# Altium schematic sheet KeyLED.SchDoc
size A3
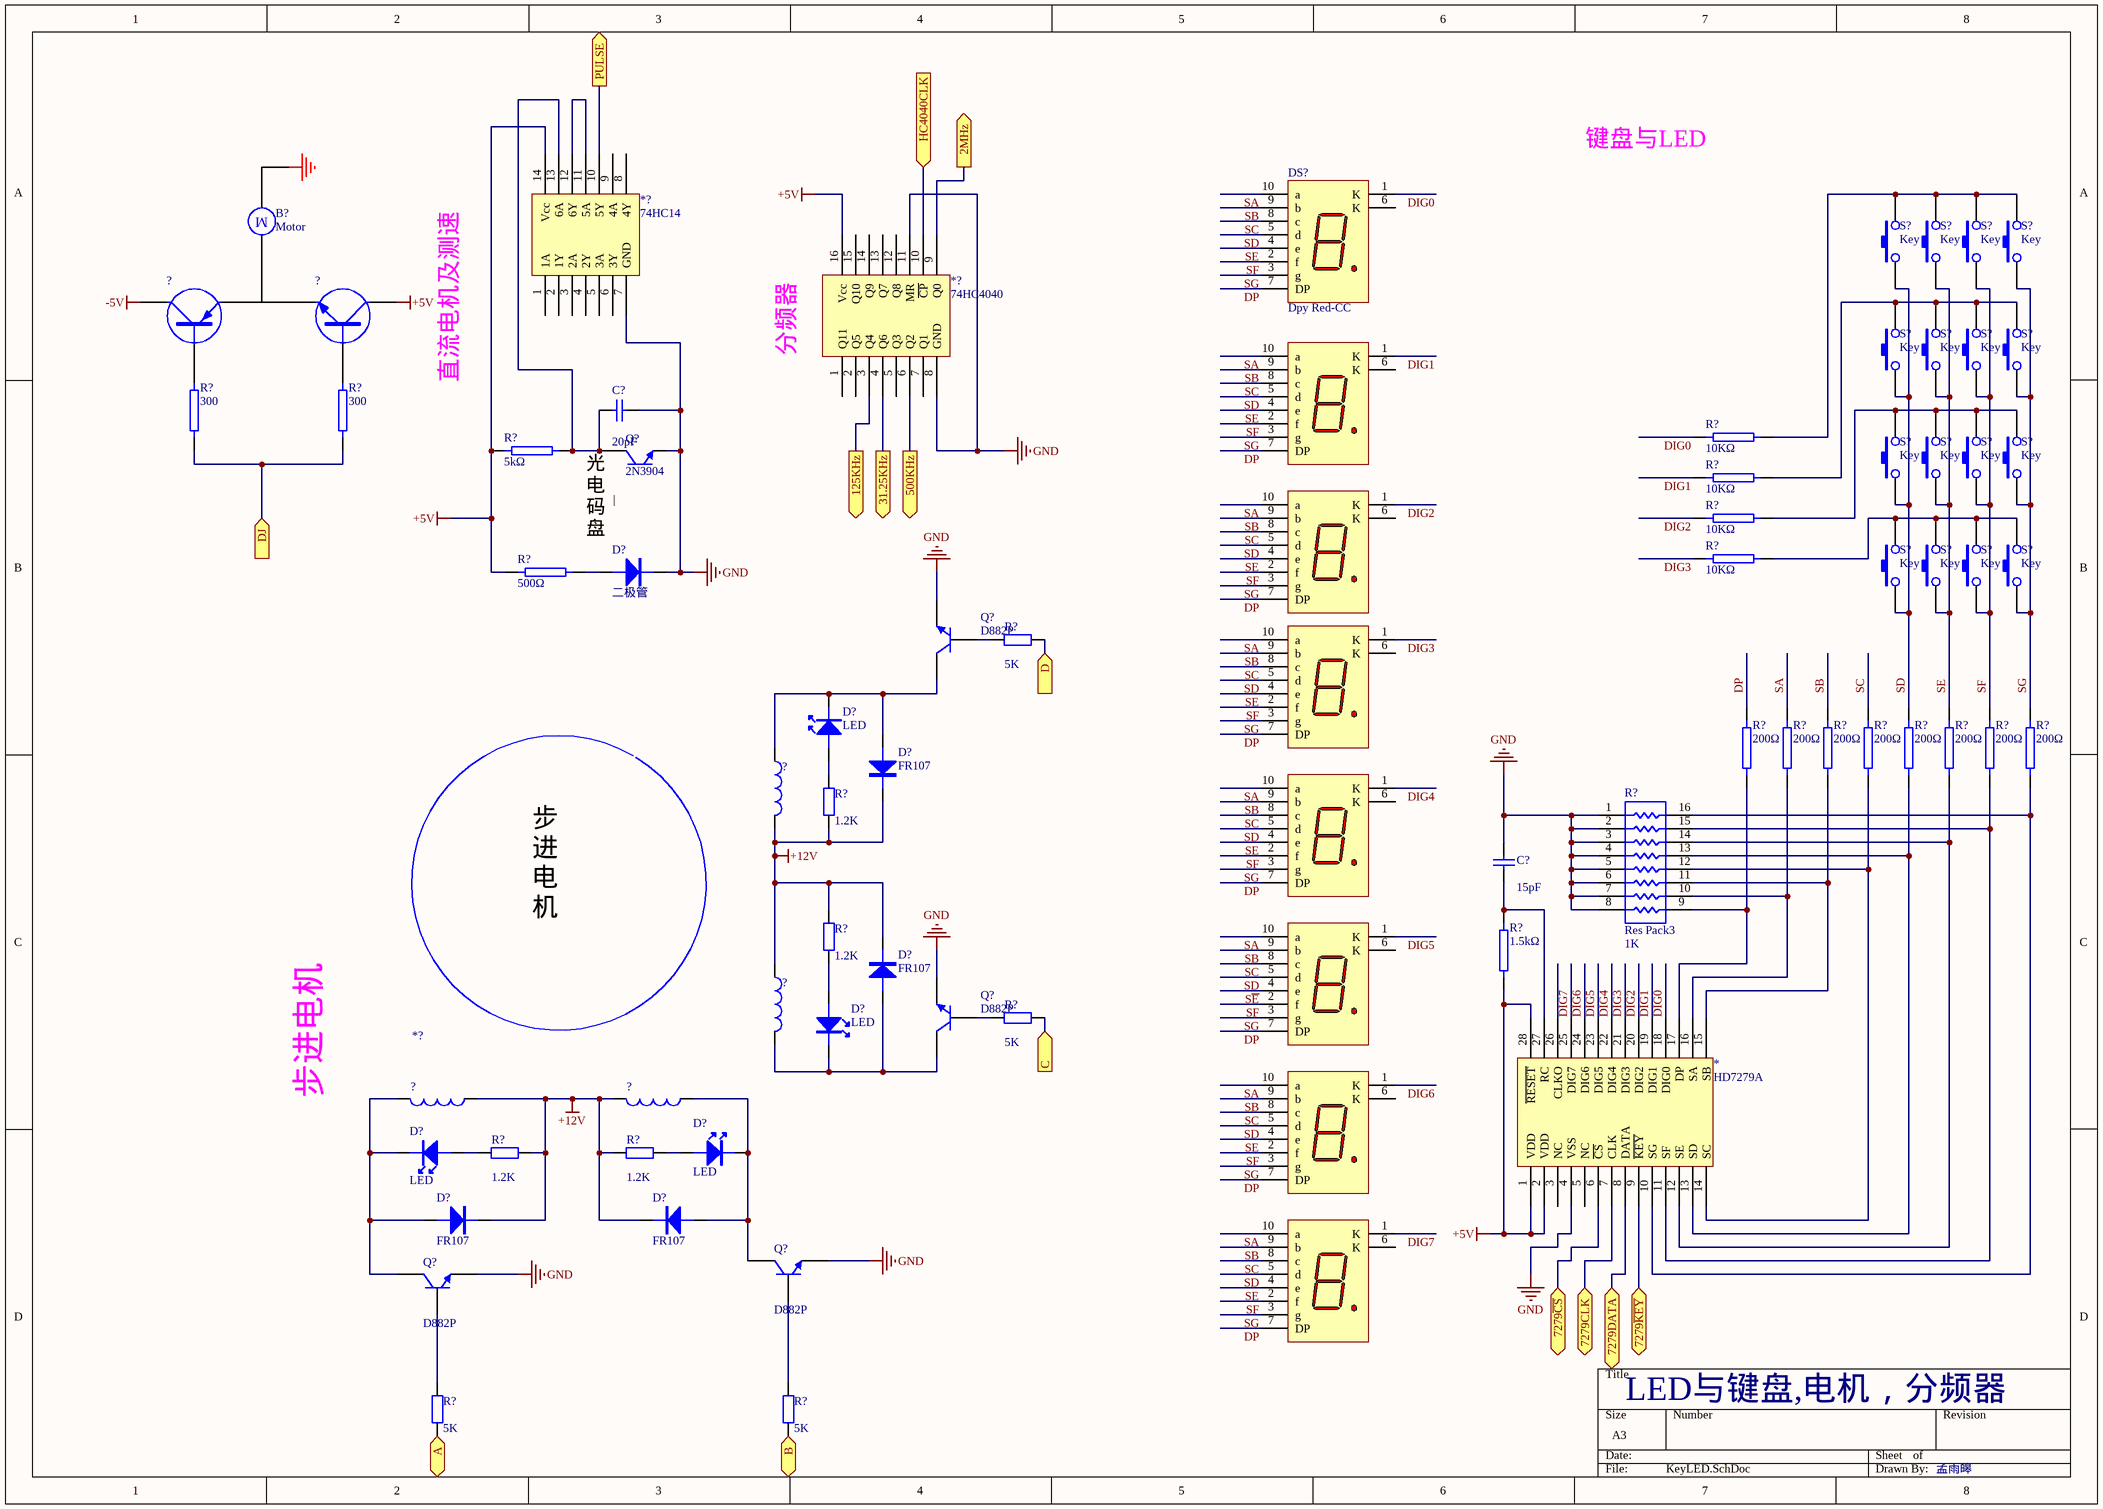
[diagram p0: KeyLED.SchDoc]

## Parts
(Parts that share a designator on the sheet are numbered #1, #2 ... from top to bottom, then left to right.)
*  HD7279A
*?#1  74HC14
*?#2  74HC4040
*?#3  bujindianji  (value not drawn)
?#1  (no value)
?#2  (no value)
?#3  Inductor  [INDC1005AL]  (value not drawn)
?#4  (no value)  [INDC1005AL]
?#5  Inductor  [INDC1005AL]  (value not drawn)
?#6  Inductor  [INDC1005AL]  (value not drawn)
B?  Motor  [RB5-10.5]
C?#1  value 20pF  [RAD-0.3]
C?#2  value 15pF  [RAD-0.3]
D?#1  二极管
D?#2  LED
D?#3  FR107
D?#4  FR107
D?#5  LED
D?#6  LED
D?#7  LED
D?#8  FR107
D?#9  FR107
DS?#1  Dpy Red-CC  [A]
DS?#2  Dpy Red-CC  [A]  (value not drawn)
DS?#3  Dpy Red-CC  [A]  (value not drawn)
DS?#4  Dpy Red-CC  [A]  (value not drawn)
DS?#5  Dpy Red-CC  [A]  (value not drawn)
DS?#6  Dpy Red-CC  [A]  (value not drawn)
DS?#7  Dpy Red-CC  [A]  (value not drawn)
DS?#8  Dpy Red-CC  [A]  (value not drawn)
Q?#1  2N3904  [BCY-W3/E4]
Q?#2  D882P  [sot-23]
Q?#3  D882P  [sot-23]
Q?#4  D882P  [sot-23]
Q?#5  D882P  [sot-23]
R?#1  300
R?#2  300
R?#3  10KΩ
R?#4  5kΩ
R?#5  10KΩ
R?#6  10KΩ
R?#7  10KΩ
R?#8  500Ω
R?#9  value 5K  [AXIAL-0.4]
R?#10  200Ω
R?#11  200Ω
R?#12  200Ω
R?#13  200Ω
R?#14  200Ω
R?#15  200Ω
R?#16  200Ω
R?#17  200Ω
R?#18  Res Pack3  value 1K  [SO-16_N]
R?#19  value 1.2K  [AXIAL-0.4]
R?#20  value 1.2K  [AXIAL-0.4]
R?#21  1.5kΩ
R?#22  value 5K  [AXIAL-0.4]
R?#23  value 1.2K  [AXIAL-0.4]
R?#24  value 1.2K  [AXIAL-0.4]
R?#25  value 5K  [AXIAL-0.4]
R?#26  value 5K  [AXIAL-0.4]
S?#1  Key
S?#2  Key
S?#3  Key
S?#4  Key
S?#5  Key
S?#6  Key
S?#7  Key
S?#8  Key
S?#9  Key
S?#10  Key
S?#11  Key
S?#12  Key
S?#13  Key
S?#14  Key
S?#15  Key
S?#16  Key

## Ports
2MHz (out), 31.25KHz (out), 125KHz (out), 500KHz (out), 7279CLK, 7279DATA, 7279~{CS} (bidir), 7279~{KEY}, A (in), B (in), C (in), D (in), DJ (in), HC4040CLK (in), PULSE (out)

## Nets
+5V: *.1(VDD) *.2(VDD) *.28(~{RESET}) *?#1.14(Vcc) *?#2.16(Vcc) ?#2.2(C) R?#4.2 R?#8.2 R?#21.2
+12V: ?#3.2 ?#4.1 ?#5.1 ?#6.2 D?#3.K D?#4.K D?#8.K D?#9.K R?#19.1 R?#20.1 R?#23.1 R?#24.1
-5V: ?#1.3(C)
GND: *.4(VSS) *?#1.7(GND) *?#2.8(GND) *?#2.11(MR) C?#1.1 C?#2.1 D?#1.K Q?#1.1(E) Q?#2.2(E) Q?#3.2(E) Q?#4.2(E) Q?#5.2(E) R?#18.1 R?#18.2 R?#18.3 R?#18.4 R?#18.5 R?#18.6 R?#18.7 R?#18.8
2MHz: *?#2.9(Q0) ; port 2MHz
31.25KHz: *?#2.4(Q6) ; port 31.25KHz
125KHz: *?#2.3(Q4) ; port 125KHz
500KHz: *?#2.6(Q2) ; port 500KHz
7279~{CS}: *.6(~{CS}) ; port 7279~{CS}
7279CLK: *.7(CLK) ; port 7279CLK
7279DATA: *.8(DATA) ; port 7279DATA
7279~{KEY}: *.9(~{KEY}) ; port 7279~{KEY}
A: R?#25.1 ; port A
B: R?#26.1 ; port B
C: R?#22.1 ; port C
D: R?#9.1 ; port D
DIG0: *.18(DIG0) DS?#1.1(K) R?#3.2
DIG1: *.19(DIG1) DS?#2.1(K) R?#5.2
DIG2: *.20(DIG2) DS?#3.1(K) R?#6.2
DIG3: *.21(DIG3) DS?#4.1(K) R?#7.2
DIG4: *.22(DIG4) DS?#5.1(K)
DIG5: *.23(DIG5) DS?#6.1(K)
DIG6: *.24(DIG6) DS?#7.1(K)
DIG7: *.25(DIG7) DS?#8.1(K)
DJ: R?#1.1 R?#2.1 ; port DJ
DP: DS?#1.7(DP) DS?#2.7(DP) DS?#3.7(DP) DS?#4.7(DP) DS?#5.7(DP) DS?#6.7(DP) DS?#7.7(DP) DS?#8.7(DP) R?#10.2
HC4040CLK: *?#2.10(~{CP}) ; port HC4040CLK
PULSE: *?#1.10(5Y) ; port PULSE
SA: DS?#1.10(a) DS?#2.10(a) DS?#3.10(a) DS?#4.10(a) DS?#5.10(a) DS?#6.10(a) DS?#7.10(a) DS?#8.10(a) R?#11.2
SB: DS?#1.9(b) DS?#2.9(b) DS?#3.9(b) DS?#4.9(b) DS?#5.9(b) DS?#6.9(b) DS?#7.9(b) DS?#8.9(b) R?#12.2
SC: DS?#1.8(c) DS?#2.8(c) DS?#3.8(c) DS?#4.8(c) DS?#5.8(c) DS?#6.8(c) DS?#7.8(c) DS?#8.8(c) R?#13.2
SD: DS?#1.5(d) DS?#2.5(d) DS?#3.5(d) DS?#4.5(d) DS?#5.5(d) DS?#6.5(d) DS?#7.5(d) DS?#8.5(d) R?#14.2 S?#1.1 S?#5.1 S?#9.1 S?#13.1
SE: DS?#1.4(e) DS?#2.4(e) DS?#3.4(e) DS?#4.4(e) DS?#5.4(e) DS?#7.4(e) DS?#8.4(e) R?#15.2 S?#2.1 S?#6.1 S?#10.1 S?#14.1
S~{E}: DS?#6.4(e)
SF: DS?#1.2(f) DS?#2.2(f) DS?#3.2(f) DS?#4.2(f) DS?#5.2(f) DS?#6.2(f) DS?#7.2(f) DS?#8.2(f) R?#16.2 S?#3.1 S?#7.1 S?#11.1 S?#15.1
SG: DS?#1.3(g) DS?#2.3(g) DS?#3.3(g) DS?#4.3(g) DS?#5.3(g) DS?#6.3(g) DS?#7.3(g) DS?#8.3(g) R?#17.2 S?#4.1 S?#8.1 S?#12.1 S?#16.1
Net*?#1_11: *?#1.11(5A) *?#1.12(6Y)
Net*?#1_13: *?#1.13(6A) C?#1.2 Q?#1.3(C) R?#4.1
Net*_10: *.10(SG) R?#17.1 R?#18.16
Net*_11: *.11(SF) R?#16.1 R?#18.15
Net*_12: *.12(SE) R?#15.1 R?#18.14
Net*_13: *.13(SD) R?#14.1 R?#18.13
Net*_14: *.14(SC) R?#13.1 R?#18.12
Net*_15: *.15(SB) R?#12.1 R?#18.11
Net*_16: *.16(SA) R?#11.1 R?#18.10
Net*_17: *.17(DP) R?#10.1 R?#18.9
Net*_27: *.27(RC) C?#2.2 R?#21.1
Net?#1_1: ?#1.1(B) R?#1.2
Net?#2_1: ?#2.1(B) R?#2.2
Net?#3_1: ?#3.1 D?#2.2 D?#3.A Q?#2.3(C)
Net?#4_2: ?#4.2 D?#4.A D?#5.2 Q?#3.3(C)
Net?#5_2: ?#5.2 D?#6.2 D?#8.A Q?#5.3(C)
Net?#6_1: ?#6.1 D?#7.2 D?#9.A Q?#4.3(C)
NetD?#1_A: D?#1.A R?#8.1
NetD?#2_1: D?#2.1 R?#19.2
NetD?#5_1: D?#5.1 R?#20.2
NetD?#6_1: D?#6.1 R?#24.2
NetD?#7_1: D?#7.1 R?#23.2
NetQ?#2_1: Q?#2.1(B) R?#9.2
NetQ?#3_1: Q?#3.1(B) R?#22.2
NetQ?#4_1: Q?#4.1(B) R?#26.2
NetQ?#5_1: Q?#5.1(B) R?#25.2
NetR?#3_1: R?#3.1 S?#1.2 S?#2.2 S?#3.2 S?#4.2
NetR?#5_1: R?#5.1 S?#5.2 S?#6.2 S?#7.2 S?#8.2
NetR?#6_1: R?#6.1 S?#9.2 S?#10.2 S?#11.2 S?#12.2
NetR?#7_1: R?#7.1 S?#13.2 S?#14.2 S?#15.2 S?#16.2

Not connected (* = marked no-connect by the designer): * 3(NC) 5(NC) 26(CLKO); *?#1 1(1A) 2(1Y) 3(2A) 4(2Y) 5(3A) 6(3Y) 8(4Y) 9(4A); *?#2 1(Q11) 2(Q5) 5(Q3) 7(Q1) 12(Q8) 13(Q7) 14(Q9) 15(Q10); ?#1 2(E); ?#2 3(E); B? 1 2; DS?#1 6(K); DS?#2 6(K); DS?#3 6(K); DS?#4 6(K); DS?#5 6(K); DS?#6 6(K); DS?#7 6(K); DS?#8 6(K)

## Notes on the sheet
- 键盘与LED
- 直流电机及测速
- (near *?#2) 分频器
- (near Q?#1) |
  |
  |
  |
- (near Q?#1) 光电码盘
- 步进电机
- LED与键盘,电机，分频器
- 孟雨皞
- Labels drawn without touching a wire or pin: GND
- (in symbol bujindianji) 步进电机
- (in symbol Motor) M

## Library data of the parts
?#1 = PNP: PNP Transistor
?#2 = NPN: NPN Transistor
?#3-?#6 = Inductor: Code_IEC: 1005; Value: 10mH; Published: 8-Jun-2000; LatestRevisionDate: 29-May-2009; LatestRevisionNote: IPC-7351 Footprint Added.; PackageReference: 0402-A; Publisher: Altium Limited; PackageDescription: Chip Inductor; Code_JEITA: 0402
B? = Motor: Motor, General Kind; Published: 24-Mar-1999; LatestRevisionDate: 17-Jul-2002; LatestRevisionNote: Re-released for DXP Platform.; PackageReference: RB5-10.5; Publisher: Altium Limited; PackageDescription: Capacitor (Radial); 2 Leads
C?#1 C?#2 = Cap: Capacitor; Published: 8-Jun-2000; LatestRevisionDate: 17-Jul-2002; LatestRevisionNote: Re-released for DXP Platform.; PackageReference: RAD-0.3; Publisher: Altium Limited
D?#3 D?#4 D?#8 D?#9 = 二极管
DS?#1-DS?#8 = Dpy Red-CC: 7.62 mm Black Surface HER 7-Segment Display: CC, RH DP; MinimumIntensity: 360 ucd; Note: IF = 5 mA; Colour: High Efficiency Red (HER); Note: Pins 1 and 6 are redundant Cathodes.; Published: 8-Jun-2000; LatestRevisionDate: 17-Dec-2003; LatestRevisionNote: Schematic revised, PCB Footprint replaced.; DatasheetVersion: 19-Feb-2002; PackageVersion: 11-Feb-2002; PackageReference: A; Publisher: Altium Limited; PackageDescription: LED, 7-Segment Display, 7.62 mm, RHD; 10 Leads; Row Space 5.08 mm; Pitch 2.54 mm; ComponentLink1Description: Manufacturer Link; ComponentLink1URL: http://www.agilent.com/
Q?#1-Q?#5 = 2N3904: NPN General Purpose Amplifier; Published: 8-Jun-2000; LatestRevisionDate: 15-Jan-2003; LatestRevisionNote: PCB Footprint 'BCY-W3/D4.7' replaced; PackageReference: TO-92A; Publisher: Altium Limited; Code_JEDEC: TO-92A; ComponentLink1Description: Manufacturer Link; ComponentLink1URL: http://www.fairchildsemi.com/; ComponentLink2Description: Datasheet; ComponentLink2URL: http://www.fairchildsemi.com/ds/2N%2F2N3904.pdf
  Q?#1: DatasheetVersion: 1997; PackageVersion: Sep-1998
  Q?#2-Q?#5: DatasheetDocument: 1997; PackageDocument: Sep-1998
R?#1-R?#8 R?#10-R?#17 R?#21 = 电阻
R?#9 R?#19 R?#20 R?#22-R?#26 = Res2: Resistor; Published: 8-Jun-2000; LatestRevisionDate: 17-Jul-2002; LatestRevisionNote: Re-released for DXP Platform.; PackageReference: AXIAL-0.4; Publisher: Altium Limited
R?#18 = Res Pack3: Isolated Resistor Network; Published: 24-Mar-1999; LatestRevisionDate: 29-May-2009; LatestRevisionNote: IPC-7351 Footprint Added.; PackageReference: SO-16; Publisher: Altium Limited; PackageDescription: 16-Pin Small Outline Integrated Circuit 1.27 mm Pitch; Code_JEDEC: MS-012-AC; Code_IPC: SOIC127P600-16